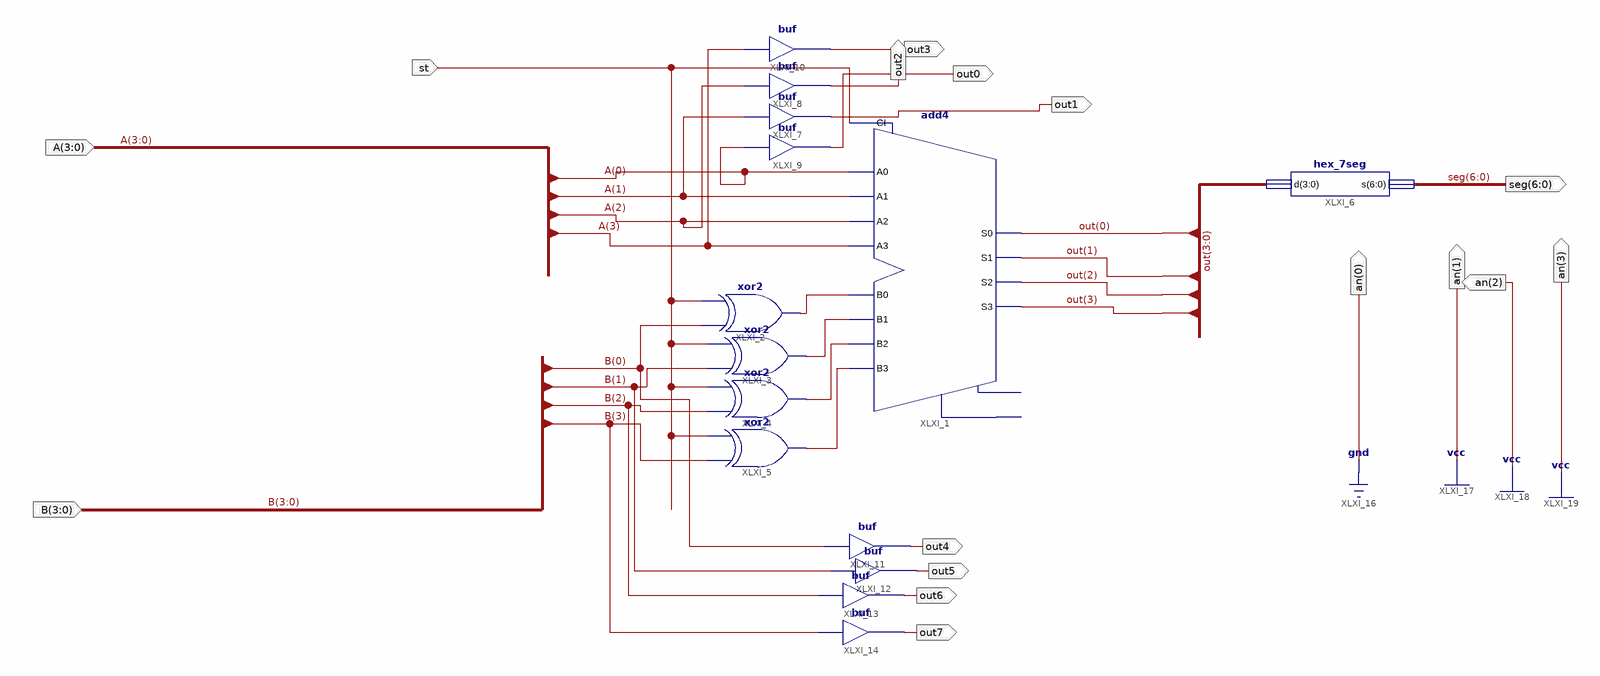
[diagram p0: schematic sheet 1]
// Xilinx ISE schematic alu1_remake.sch (spartan3e) as structural Verilog: 14 symbols, 16 ports
module alu1_remake (
  input  [3:0] A,
  input  [3:0] B,
  input  st,
  output [6:0] seg,
  output out3,
  output out2,
  output out0,
  output out1,
  output out4,
  output out5,
  output out6,
  output out7,
  output [3:0] an
);

  wire XLXN_16, XLXN_26, XLXN_27, XLXN_28;
  wire [3:0] out;

  add4 XLXI_1 (
    .A0(A[0]), .A1(A[1]), .A2(A[2]), .A3(A[3]), .B0(XLXN_16), .B1(XLXN_26), .B2(XLXN_27), .B3(XLXN_28),
    .CI(st), .S0(out[0]), .S1(out[1]), .S2(out[2]), .S3(out[3]));  // open: CO, OFL
  xor XLXI_2 (XLXN_16, B[0], st);
  xor XLXI_3 (XLXN_26, B[1], st);
  xor XLXI_4 (XLXN_27, B[2], st);
  xor XLXI_5 (XLXN_28, B[3], st);
  hex_7seg XLXI_6 (.d(out), .s(seg));
  buf XLXI_7 (out1, A[1]);
  buf XLXI_8 (out2, A[2]);
  buf XLXI_9 (out0, A[0]);
  buf XLXI_10 (out3, A[3]);
  buf XLXI_11 (out4, B[0]);
  buf XLXI_12 (out5, B[1]);
  buf XLXI_13 (out6, B[2]);
  buf XLXI_14 (out7, B[3]);

  assign an = 4'b1110;
endmodule
